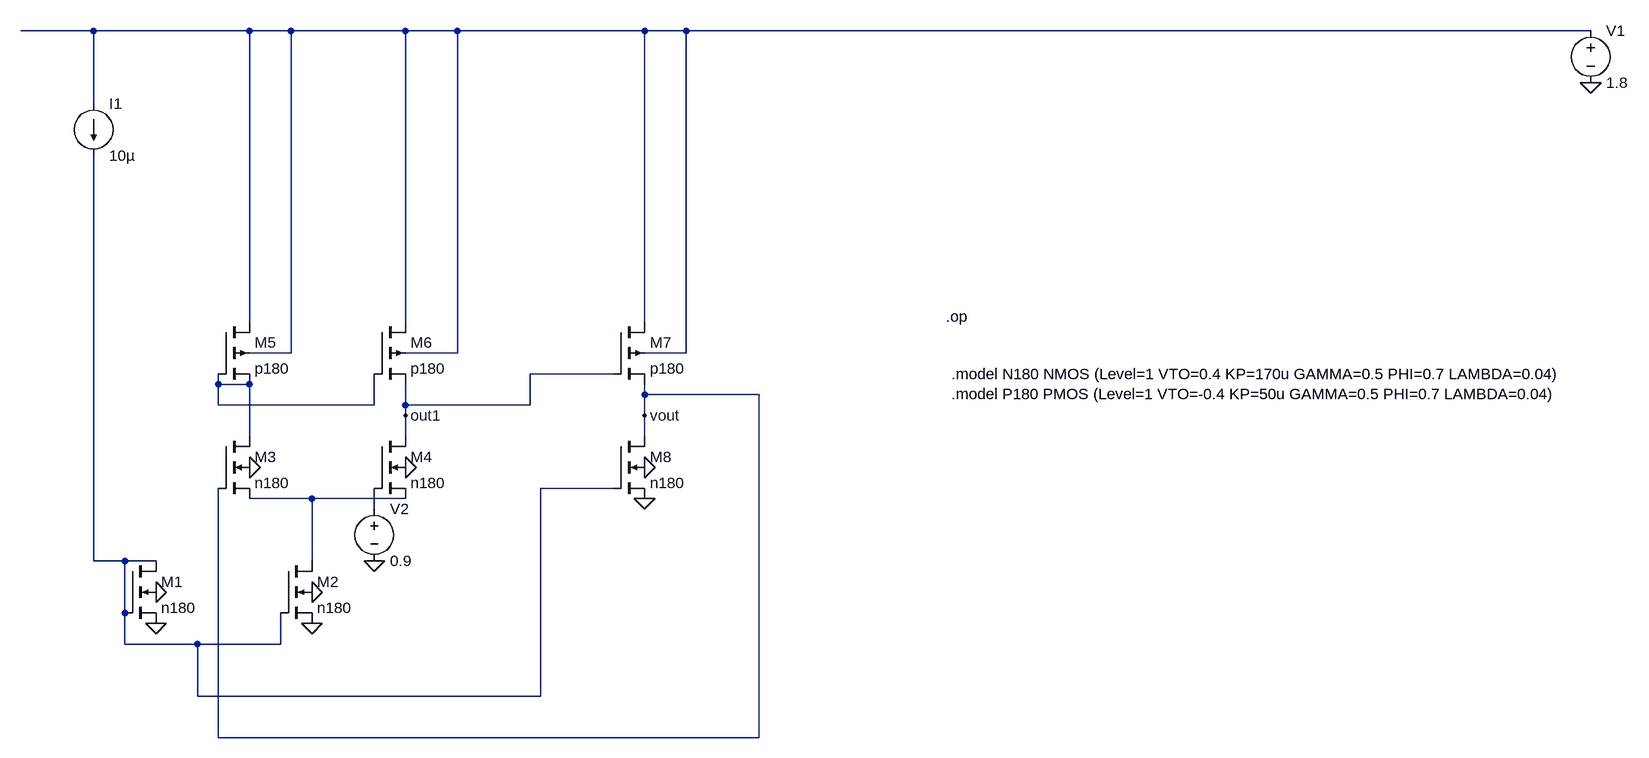
[diagram p0: schematic operational amplifier.asc]
operational amplifier.asc, the LTspice schematic file:
Version 4.1
SHEET 1 2384 680
WIRE 16 -864 -96 -864
WIRE 256 -864 16 -864
WIRE 320 -864 256 -864
WIRE 496 -864 320 -864
WIRE 576 -864 496 -864
WIRE 864 -864 576 -864
WIRE 928 -864 864 -864
WIRE 2320 -864 928 -864
WIRE 16 -752 16 -864
WIRE 256 -416 256 -864
WIRE 496 -416 496 -864
WIRE 864 -416 864 -864
WIRE 320 -368 320 -864
WIRE 320 -368 256 -368
WIRE 576 -368 576 -864
WIRE 576 -368 496 -368
WIRE 928 -368 928 -864
WIRE 928 -368 864 -368
WIRE 816 -336 688 -336
WIRE 208 -320 208 -336
WIRE 256 -320 208 -320
WIRE 864 -304 864 -320
WIRE 1040 -304 864 -304
WIRE 208 -288 208 -320
WIRE 448 -288 448 -336
WIRE 448 -288 208 -288
WIRE 496 -288 496 -320
WIRE 688 -288 688 -336
WIRE 688 -288 496 -288
WIRE 496 -272 496 -288
WIRE 864 -272 864 -304
WIRE 256 -240 256 -320
WIRE 496 -240 496 -272
WIRE 864 -240 864 -272
WIRE 816 -160 704 -160
WIRE 352 -144 256 -144
WIRE 496 -144 352 -144
WIRE 448 -128 448 -160
WIRE 16 -48 16 -672
WIRE 64 -48 16 -48
WIRE 112 -48 64 -48
WIRE 352 -48 352 -144
WIRE 64 32 64 -48
WIRE 64 80 64 32
WIRE 176 80 64 80
WIRE 304 80 304 32
WIRE 304 80 176 80
WIRE 176 160 176 80
WIRE 704 160 704 -160
WIRE 704 160 176 160
WIRE 208 224 208 -160
WIRE 1040 224 1040 -304
WIRE 1040 224 208 224
FLAG 2320 -784 0
FLAG 112 48 0
FLAG 352 48 0
FLAG 112 0 0
FLAG 352 0 0
FLAG 496 -272 out1
FLAG 864 -144 0
FLAG 864 -192 0
FLAG 864 -272 vout
FLAG 448 -48 0
FLAG 256 -192 0
FLAG 496 -192 0
SYMBOL voltage 2320 -880 R0
WINDOW 123 0 0 Left 0
WINDOW 39 0 0 Left 0
SYMATTR InstName V1
SYMATTR Value 1.8
SYMBOL nmos4 64 -48 R0
SYMATTR InstName M1
SYMATTR Value n180
SYMATTR Value2 l=0.54u w=5.4u
SYMBOL nmos4 304 -48 R0
SYMATTR InstName M2
SYMATTR Value n180
SYMATTR Value2 l=0.54u w=5.4u
SYMBOL current 16 -752 R0
WINDOW 123 0 0 Left 0
WINDOW 39 0 0 Left 0
SYMATTR InstName I1
SYMATTR Value 10µ
SYMBOL nmos4 208 -240 R0
SYMATTR InstName M3
SYMATTR Value n180
SYMATTR Value2 l=0.54u w=5.4u
SYMBOL nmos4 448 -240 R0
SYMATTR InstName M4
SYMATTR Value n180
SYMATTR Value2 l=0.54u w=5.4u
SYMBOL pmos4 208 -416 R0
SYMATTR InstName M5
SYMATTR Value p180
SYMATTR Value2 l=0.54u w=10.8u
SYMBOL pmos4 448 -416 R0
SYMATTR InstName M6
SYMATTR Value p180
SYMATTR Value2 l=0.54u w=10.8u
SYMBOL pmos4 816 -416 R0
SYMATTR InstName M7
SYMATTR Value p180
SYMATTR Value2 l=0.54u w=10.8u
SYMBOL nmos4 816 -240 R0
SYMATTR InstName M8
SYMATTR Value n180
SYMATTR Value2 l=0.54u w=5.4u
SYMBOL voltage 448 -144 R0
WINDOW 123 0 0 Left 0
WINDOW 39 0 0 Left 0
SYMATTR InstName V2
SYMATTR Value 0.9
TEXT 1336 -336 Left 2 !.model N180 NMOS (Level=1 VTO=0.4 KP=170u GAMMA=0.5 PHI=0.7 LAMBDA=0.04)\n.model P180 PMOS (Level=1 VTO=-0.4 KP=50u GAMMA=0.5 PHI=0.7 LAMBDA=0.04)
TEXT 1328 -424 Left 2 !.op

The netlist it stands for:
* operational amplifier.asc
V1 N001 0 1.8
M1 N003 N003 0 0 n180 l=0.54u w=5.4u
M2 N004 N003 0 0 n180 l=0.54u w=5.4u
I1 N001 N003 10µ
M3 N002 vout N004 0 n180 l=0.54u w=5.4u
M4 out1 N005 N004 0 n180 l=0.54u w=5.4u
M5 N001 N002 N002 N001 p180 l=0.54u w=10.8u
M6 N001 N002 out1 N001 p180 l=0.54u w=10.8u
M7 N001 out1 vout N001 p180 l=0.54u w=10.8u
M8 vout N003 0 0 n180 l=0.54u w=5.4u
V2 N005 0 0.9
.model NMOS NMOS
.model PMOS PMOS
.lib standard.mos
.model N180 NMOS (Level=1 VTO=0.4 KP=170u GAMMA=0.5 PHI=0.7 LAMBDA=0.04)
.model P180 PMOS (Level=1 VTO=-0.4 KP=50u GAMMA=0.5 PHI=0.7 LAMBDA=0.04)
.op
.backanno
.end